# Altium schematic sheet STRWL-S05-V00-Master-PSU3V3-300mA.SchDoc: Power Supply (20-40V to 3v3 @ 0.1-0.6A)
size A3; DrawnBy: Jonn Dillon; DocumentNumber: 2; Revision: 01; SheetNumber: 5; SheetTotal: 7; Version: 01; Project: AMU 2020 (Sourced from BMS 2020); PageSetup: Record=PageOptions|CenterHorizontal=True|CenterVertical=True|PrintScale=0.97|XCorrection=1.00|YCorrection=1.00|PrintKind=0|BorderSize=5000000|LeftOffset=0|BottomOffset=0|Orientation=2|PaperLength=1000|PaperWidth=1000|Scale=100|PaperSource=7|PrintQuality=-4|MediaType=1|DitherType=10|PaperKind=A4|PrintScaleMode=1
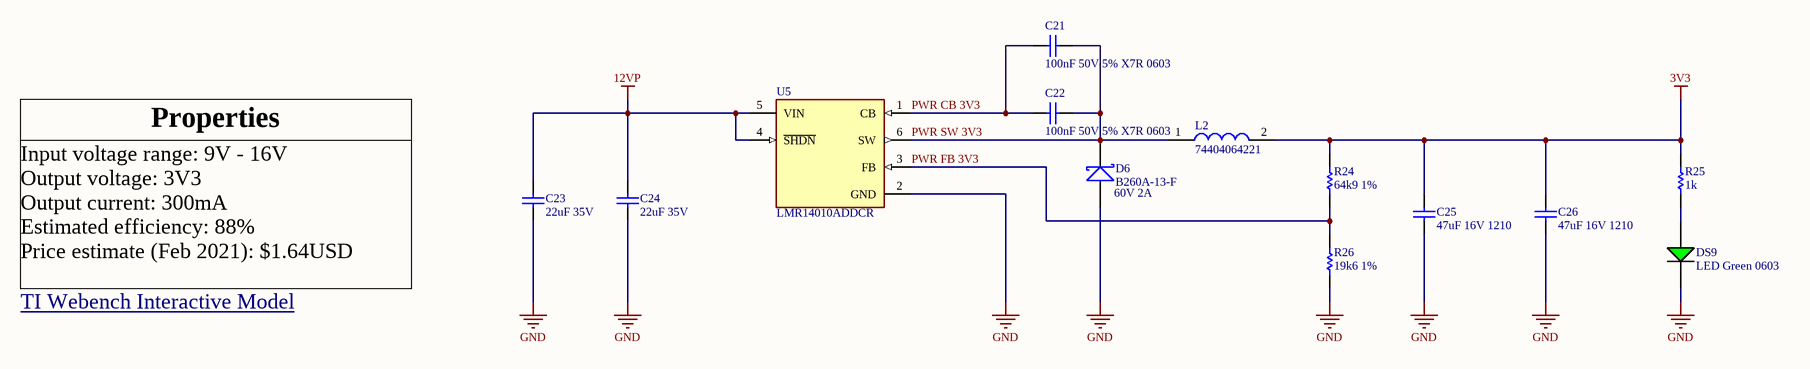
[diagram p0: STRWL-S05-V00-Master-PSU3V3-300mA.SchDoc]

## Parts
C21  100nF 50V 5% X7R 0603  [Cap_Ceramic_0603]
C22  100nF 50V 5% X7R 0603  [Cap_Ceramic_0603]
C23  22uF 35V  [Cap_Ceramic_1206]
C24  22uF 35V  [Cap_Ceramic_1206]
C25  47uF 16V 1210  [Cap_Ceramic_1210]
C26  47uF 16V 1210  [Cap_Ceramic_1210]
D6  B260A-13-F  [SMA]
DS9  LED Green 0603  [LED GREEN 0603]
L2  74404064221  [Inductor_6x6mm]
R24  64k9 1%  [Res_ThinFilm_0603]
R25  1k  [Res_ThinFilm_0603]
R26  19k6 1%  [Res_ThinFilm_0603]
U5  LMR14010ADDCR  [FP-DDC0006A-MFG]

## Nets
3V3: C25.2 C26.2 L2.2 R24.2 R25.2
12VP: C23.1 C24.1 U5.4(~{SHDN}) U5.5(VIN)
GND: C23.2 C24.2 C25.1 C26.1 D6.A DS9.2(C) R26.1 U5.2(GND)
PWR CB 3V3: C21.1 C22.1 U5.1(CB)
PWR FB 3V3: R24.1 R26.2 U5.3(FB)
PWR SW 3V3: C21.2 C22.2 D6.K L2.1 U5.6(SW)
NetDS9_1: DS9.1(A) R25.1

## Notes on the sheet
- Properties
- (near D6) 60V 2A
- Input voltage range: 9V - 16V
  Output voltage: 3V3
  Output current: 300mA
  Estimated efficiency: 88%
  Price estimate (Feb 2021): $1.64USD
- TI Webench Interactive Model <https://webench.ti.com/power-designer/switching-regulator/customize/16?O1I=0.3&O1V=3.3&VinMax=16.0&VinMin=9.0&action=schematic&base_pn=LMR14010A&lang_chosen=en_US&op_TA=30.0&optFactor=3&origin=ODS__LMR14010A>
- Title
- Size:
- Date:
- A3
- Number:
- Time:
- Revision:
- Sheet
- of
- File:

## Library data of the parts
C21 C22 = 100nF 50V 5% X7R 0603: Capacitor, Ceramic, SMD, 100nF, 50V, 5%, X7R, 0603
C23 C24 = 22uF 35V 20% X5R 1206: 22µF ±20% 35V Ceramic Capacitor X5R 1206 (3216 Metric); ComponentLink1Description: Digikey; ComponentLink1URL: https://www.digikey.com.au/product-detail/en/tdk-corporation/C3216X5R1V226M160AC/445-8045-1-ND/2792165; ComponentLink2Description: Datasheet; ComponentLink2URL: https://product.tdk.com/info/en/catalog/datasheets/mlcc_commercial_general_en.pdf
C25 C26 = 47uF 16V 10% X7R 1210: Capacitor, Ceramic, SMD, 47uF, 16V, 5%, X7R, 1210
D6 = B260A-13-F: Diode, Schottky Barrier Rectifier, 60 V, 2 A, B260A-13-F
L2 = 74404064221: FIXED IND 220UH 660MA 850 MOHM; ComponentLink1Description: Digikey; ComponentLink1URL: https://www.digikey.com.au/product-detail/en/w%C3%BCrth-elektronik/74404064221/732-7261-1-ND/5353241; ComponentLink2Description: LCSC A; ComponentLink2URL: https://lcsc.com/product-detail/Power-Inductors_Sunlord-SWPA6045S221MT_C91047.html; ComponentLink3Description: LCSC B; ComponentLink3URL: https://lcsc.com/product-detail/Power-Inductors_SXN-Shun-Xiang-Nuo-Elec-SMNR6045-221MT_C467145.html
R24 = 64k9 1% 0603: Resistor, SMD, 64k9, 0.1W, 5%, 0603
R25 = 1k 5% 0603: Resistor, SMD, 1k, 0.1W, 5%, 0603
R26 = 19k6 1% 0603: Resistor, SMD, 19k6, 0.1W, 5%, 0603
U5 = CMP-04918-000056-1: IC REG BUCK ADJ 1A TSOT23-6; Manufacturer: Texas Instruments; Max Junction Temp: +125°C; Number Of Outputs: 1; Standoff Height: 0mm; Switching Frequency: 700kHz; Min Supply Voltage: 4V; Max Supply Voltage: 40V; Max Duty Cycle: 96%; Output Type: AdjustableProgrammable; Manufacturer Part Number: LMR14010ADDCR; Temperature: -40°C to +125°C; Output Current: 1A; Category: IC; Temperature Range High: +125°C; Lead Free: Yes; Switching Topology: Buck; Mouser Description: 4-V to 40-V, 1-A Step-Down Converter With High Efficiency Eco-Mode 6-SOT-23-THIN -40 to 125; Device Class L1: Integrated Circuits (ICs); Digikey Description: IC REG BUCK ADJ 1A TSOT23-6; Package: DDC0006A; Ipc Land Pattern Name: SOT95P280X110-6; Device Class L2: Power Management ICs; Temperature Range Low: -40°C; Height: 1.1mm; Device Class L3: Voltage Regulators - Switching; RoHS: TRUE; Automotive: No; Octopart: https://octopart.com/lmr14010addcr-texas+instruments-90753290; ComponentLink2URL: https://www.ti.com/lit/ds/symlink/lmr14010a.pdf; ComponentLink2Description: Datasheet